# Altium project pcb_75.PrjPcb
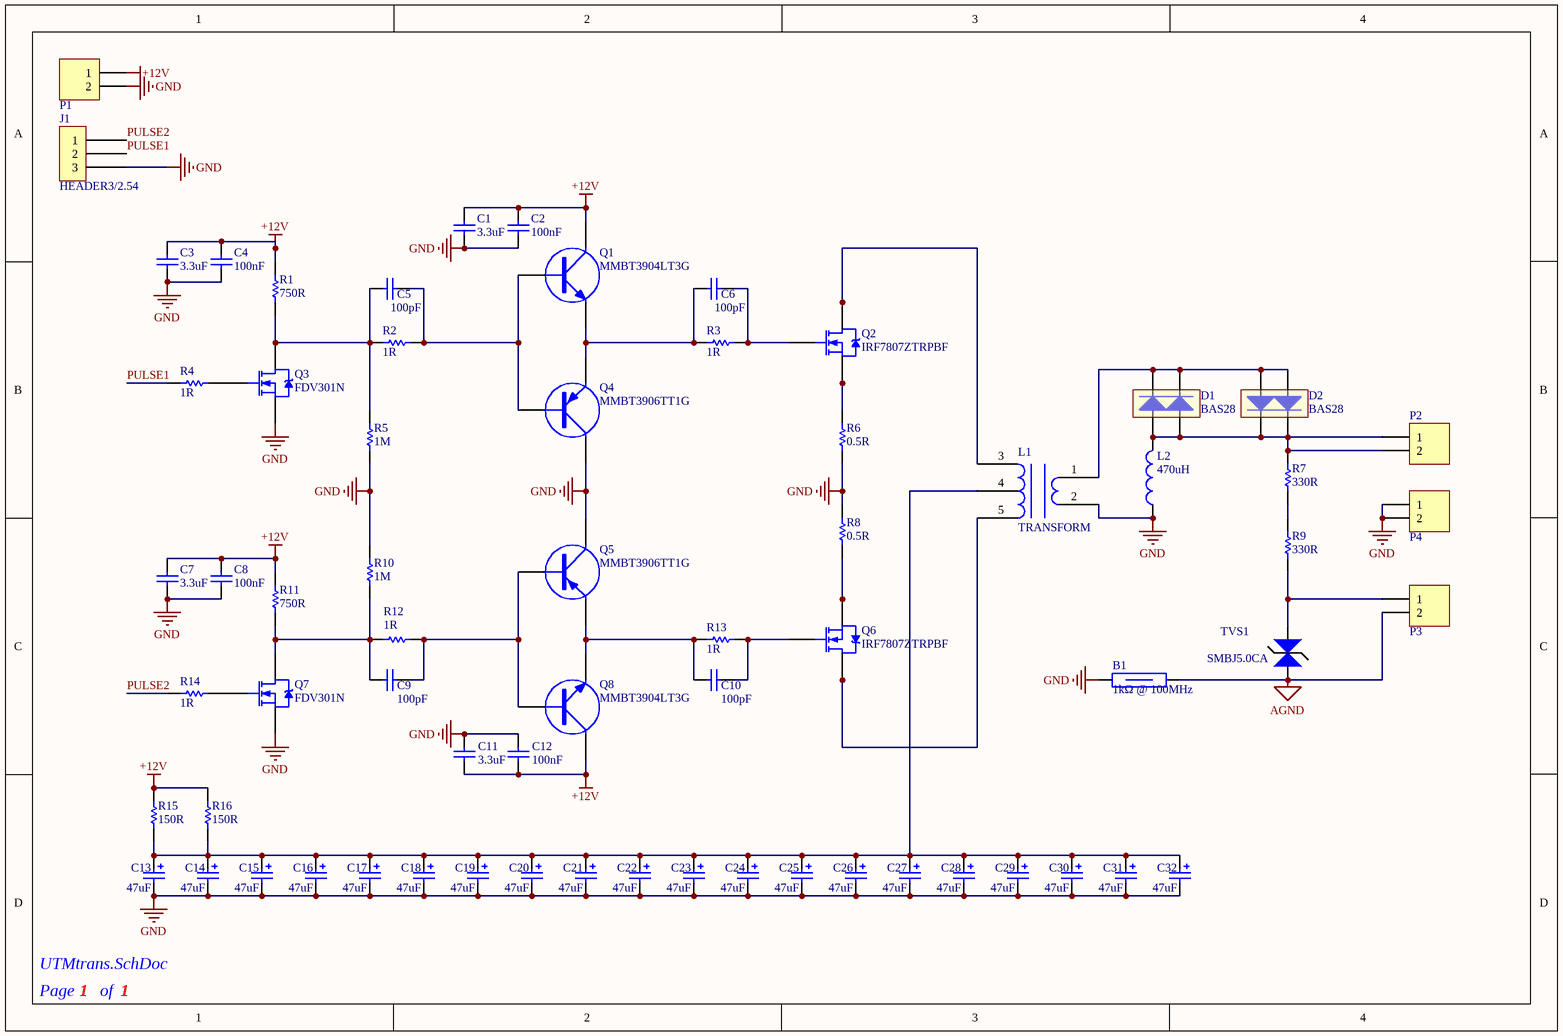
[diagram p0: UTMtrans.SchDoc]
1 sheet, 67 parts. Net scope: global (net labels, ports and power ports of the same name join across sheets).
Board file: pcb_75.PcbDoc

## Sheet UTMtrans.SchDoc
size A4; SheetNumber: 1; SheetTotal: 1

### Parts
B1  1kΩ @ 100MHz  [R1206_L]
C1  3.3uF  [R0805_C]
C2  100nF  [R0603_C]
C3  3.3uF  [R0805_C]
C4  100nF  [R0603_C]
C5  100pF  [R0603_C]
C6  100pF  [R0603_C]
C7  3.3uF  [R0805_C]
C8  100nF  [R0603_C]
C9  100pF  [R0603_C]
C10  100pF  [R0603_C]
C11  3.3uF  [R0805_C]
C12  100nF  [R0603_C]
C13  47uF  [CASE-E_7343]
C14  47uF  [CASE-E_7343]
C15  47uF  [CASE-E_7343]
C16  47uF  [CASE-E_7343]
C17  47uF  [CASE-E_7343]
C18  47uF  [CASE-E_7343]
C19  47uF  [CASE-E_7343]
C20  47uF  [CASE-E_7343]
C21  47uF  [CASE-E_7343]
C22  47uF  [CASE-E_7343]
C23  47uF  [CASE-E_7343]
C24  47uF  [CASE-E_7343]
C25  47uF  [CASE-E_7343]
C26  47uF  [CASE-E_7343]
C27  47uF  [CASE-E_7343]
C28  47uF  [CASE-E_7343]
C29  47uF  [CASE-E_7343]
C30  47uF  [CASE-E_7343]
C31  47uF  [CASE-E_7343]
C32  47uF  [CASE-E_7343]
D1  BAS28  [SOT143]
D2  BAS28  [SOT143]
J1  HEADER3/2.54  [SIP3/2.54]
L1  TRANSFORM  [TRANS5]
L2  470uH  [CD0.254]
P1  Header 2  [CP1X2]  (value not drawn)
P2  Header 2  [CP1X2]  (value not drawn)
P3  Header 2  [CP1X2]  (value not drawn)
P4  Header 2  [CP1X2]  (value not drawn)
Q1  MMBT3904LT3G  [SOT-23(SOT-23-3)]
Q2  IRF7807ZTRPBF  [SOP-8_150mil]
Q3  FDV301N  [SOT-23]
Q4  MMBT3906TT1G  [SOT-23(SOT-23-3)]
Q5  MMBT3906TT1G  [SOT-23(SOT-23-3)]
Q6  IRF7807ZTRPBF  [SOP-8_150mil]
Q7  FDV301N  [SOT-23]
Q8  MMBT3904LT3G  [SOT-23(SOT-23-3)]
R1  750R  [R2512_R]
R2  1R  [R0603_R]
R3  1R  [R0603_R]
R4  1R  [R0603_R]
R5  1M  [R0603_R]
R6  0.5R  [R2512_R]
R7  330R  [R2512_R]
R8  0.5R  [R2512_R]
R9  330R  [R2512_R]
R10  1M  [R0603_R]
R11  750R  [R2512_R]
R12  1R  [R0603_R]
R13  1R  [R0603_R]
R14  1R  [R0603_R]
R15  150R  [R2512_R]
R16  150R  [R2512_R]
TVS1  SMBJ5.0CA  [SMB]

### Nets
+12V: C1.2 C2.2 C3.2 C4.2 C7.2 C8.2 C11.2 C12.2 P1.1 Q1.3(C) Q8.3(C) R1.2 R11.2 R15.2 R16.2
AGND: B1.2 P3.2 TVS1.1
GND: B1.1 C1.1 C2.1 C3.1 C4.1 C7.1 C8.1 C11.1 C12.1 C13.2 C14.2 C15.2 C16.2 C17.2 C18.2 C19.2 C20.2 C21.2 C22.2 C23.2 C24.2 C25.2 C26.2 C27.2 C28.2 C29.2 C30.2 C31.2 C32.2 J1.3 L1.2 L2.1 P1.2 P4.1 P4.2 Q3.2(S) Q4.3(C) Q5.3(C) Q7.2(S) R5.1 R6.1 R8.2 R10.2
PULSE1: J1.2 R4.1
PULSE2: J1.1 R14.1
NetC5_1: C5.1 Q1.1(B) Q4.1(B) R2.1
NetC5_2: C5.2 Q3.3(D) R1.1 R2.2 R5.2
NetC6_1: C6.1 Q1.2(E) Q4.2(E) R3.1
NetC6_2: C6.2 Q2.4(G) R3.2
NetC9_1: C9.1 Q7.3(D) R10.1 R11.1 R12.1
NetC9_2: C9.2 Q5.1(B) Q8.1(B) R12.2
NetC10_1: C10.1 Q5.2(E) Q8.2(E) R13.1
NetC10_2: C10.2 Q6.4(G) R13.2
NetC13_1: C13.1 C14.1 C15.1 C16.1 C17.1 C18.1 C19.1 C20.1 C21.1 C22.1 C23.1 C24.1 C25.1 C26.1 C27.1 C28.1 C29.1 C30.1 C31.1 C32.1 L1.4 R15.1 R16.1
NetD1_1: D1.1(K) D1.2(K) D2.3(A) D2.4(A) L1.1
NetD1_3: D1.3(A) D1.4(A) D2.1(K) D2.2(K) L2.2 P2.1 P2.2 R7.2
NetL1_3: L1.3 Q2.5(D) Q2.6(D) Q2.7(D) Q2.8(D)
NetL1_5: L1.5 Q6.5(D) Q6.6(D) Q6.7(D) Q6.8(D)
NetP3_1: P3.1 R9.1 TVS1.2
NetQ2_1: Q2.1(S) Q2.2(S) Q2.3(S) R6.2
NetQ3_1: Q3.1(G) R4.2
NetQ6_1: Q6.1(S) Q6.2(S) Q6.3(S) R8.1
NetQ7_1: Q7.1(G) R14.2
NetR7_1: R7.1 R9.2

### Notes on the sheet
- Page
- of

### Library data of the parts
B1 = 1kΩ@100MHz: 阻抗 @ 频率 1kΩ @ 100MHz / 线路数 1 / 额定电流（最大） 2A / 直流电阻（DCR）（最大） 120mΩ; 厂家: FH(风华); 型号: CBM321609U102T; 封装: 1206; 类型: Bead; 订货编码: C139169
C1 C3 C7 C11 = 3.3uF/0805/25V: 精度 ±10% / 容值 3.3uF / 额定电压 25V / 温漂系数（介质材料) X7R; 厂家: TDK; 型号: CGA4J1X7R1E335KT0Y0E; 封装: 0805; 类型: Capacitor; 订货编码: C409449
C2 C4 C8 C12 = 100nF/0603/50V: 精度 ±10% / 容值 100nF / 额定电压 50V / 温漂系数（介质材料) X7R; 厂家: FH(风华); 型号: 0603B104K500NT; 封装: 0603; 类型: Capacitor; 订货编码: C30926
C5 C6 C9 C10 = 100pF/0603/50V: 精度 ±5% / 容值 100pF / 额定电压 50V / 温漂系数（介质材料) C0G; 厂家: FH(风华); 型号: 0603CG101J500NT; 封装: 0603; 类型: Capacitor; 订货编码: C1635
C13-C32 = Cap Pol/47uF/35V: 钽电容 / 精度 ±10% / 容值 47uF / 额定电压 35V / ESR串联电阻 900 mΩ @ 100kHz / 工作温度 -55℃~125℃; 厂家: AVX; 型号: TAJE476K035RNJ; 订货编码: C7233; 封装: CASE-E_7343; 类型: 钽电容
D1 D2 = BAS28,215: 反向恢复时间（trr） 4ns / 直流反向耐压（Vr） 100V / 平均整流电流（Io） 150mA / 正向压降（Vf） 1.25V @ 150mA; 厂家: CJ（江苏长电/长晶）; 封装: SOT-143B; 类型: 开关二极管; 订货编码: C182938; 型号: BAS28,215
J1 = HEADER3/2.54: 3pin,单排,2.54mm间距; 厂家: /; System: Connector; 型号: /; 封装: /; 类型: /; 订货编码: /
L1 = TRANSFORM: X; 厂家: X; 型号: X; 封装: X; 类型: TRANSFORM; 订货编码: X
L2 = 470uH: 工字电感 / 精度 ±10% / 额定电流 380mA / 直流电阻（内阻） 1 Ohm Max / 电感值 470uH; 厂家: TDK; 型号: TSL0808RA-471KR38-PF; 封装: 8.5*8.3; 订货编码: C87595; 类型: 工字电感
P1-P4 = Header 2: Header, 2-Pin; 厂家: /; System: Connector; 型号: /; 封装: /; 类型: /; 订货编码: /
Q1 Q8 = MMBT3904LT3G: 300mW / 集电极电流Ic 200mA / 集射极击穿电压Vce 40V / 晶体管类型 NPN; 厂家: ON(安森美); 封装: SOT23-3; 订货编码: C150052; 型号: MMBT3904LT3G; 类型: NPN
Q2 Q6 = IRF7807ZTRPBF: 漏源电压（Vdss） 30V / 连续漏极电流（Id）（25°C 时） 11A / 栅源极阈值电压 2.25V @ 250uA / 漏源导通电阻 13.8mΩ @ 11A,10V / 最大功率耗散（Ta=25°C） 2.5W / 类型 N沟道; 厂家: Infineon(英飞凌); 封装: SOIC-8_150mil; 类型: MOS(场效应管); 订货编码: C169079; 型号: IRF7807ZTRPBF
Q3 Q7 = FDV301N: 漏源电压（Vdss） 25V / 连续漏极电流（Id）（25°C 时） 220mA / 栅源极阈值电压 1.06V @ 250uA / 漏源导通电阻 4Ω @ 400mA,4.5V / 最大功率耗散（Ta=25°C） 350mW / 类型 N沟道; 厂家: ON(安森美); 封装: SOT-23-3; 类型: MOS(场效应管); 订货编码: C15310; 型号: FDV301N
Q4 Q5 = MMBT3906TT1G: 额定功率 200mW / 集电极电流Ic 200mA / 集射极击穿电压Vce 40V / 晶体管类型 PNP; 厂家: ON(安森美); 封装: SOT23-3; 订货编码: C82042; 型号: MMBT3906TT1G; 类型: PNP
R1 R11 = 750R/2512: 精度 ±1% / 阻值 750Ω / 温度系数 ±100ppm/℃ / 功率 1W; 厂家: UNI-ROYAL(厚声); 型号: CQ121WF7500T4E; 类型: Resistor; 订货编码: C966230; 封装: 2512
R2-R4 R12-R14 = 1R/0603: ±250ppm/℃ / 精度 ±1% / 阻值 1Ω / 功率 0.1W; 厂家: FH(风华); 型号: RS-03L1R00FT; 类型: Resistor; 订货编码: C174300; 封装: 0603
R5 R10 = 1M/0603: 阻值 1MΩ / 精度 ±1% / 温度系数 ±100ppm/℃ / 功率 0.1W /; 厂家: FH(风华); 型号: RS-03K1004FT; 类型: Resistor; 订货编码: C136593; 封装: 0603
R6 R8 = 0.5R/2512: 温度系数 ±800ppm/℃ / 功率 1W / 精度 ±1% / 阻值 0.5Ω; 厂家: UNI-ROYAL(厚声); 型号: 25121WF500LT4E; 类型: Resistor; 订货编码: C27777; 封装: 2512
R7 R9 = 330R/2512: 阻值 330Ω / 精度 ±1% / 温度系数 ±100ppm/℃ / 功率 1W; 厂家: UNI-ROYAL(厚声); 型号: AC2512FK-07330RL; 类型: Resistor; 订货编码: C728177; 封装: 2512
R15 R16 = 150R/2512: 功率 1W / 精度 ±1% / 温度系数 ±100ppm/℃ / 阻值 150Ω; 厂家: UNI-ROYAL(厚声); 型号: 25121WF1500T4E; 类型: Resistor; 订货编码: C474209; 封装: 2512
TVS1 = SMBJ5.0CA: TVS二极管 / 极性 Bidirectional / 峰值脉冲电流（10/1000us） 65.2A / 箝位电压 9.2V / 击穿电压（最小值） 6.4V / 反向关断电压（典型值） 5V; 厂家: VISHAY(威世); 型号: SMBJ5.0CA-E3/52; 订货编码: C91161; 封装: SMB; 类型: TVS二极管

## Assembly variants
高等级阻感容: not fitted J1 P1 P2 P3 P4; alternate parts C1 -> CT41G-0805-X5R-25V-475-K-N, C3 -> CT41G-0805-X5R-25V-475-K-N, R6 -> RM6332(2512)-K-B-0R5-F, R8 -> RM6332(2512)-K-B-0R5-F, R10 -> RMK1608-K-B-1004-F, R5 -> RMK1608-K-B-1004-F, R12 -> RMK1608-K-B-1R0-F, R3 -> RMK1608-K-B-1R0-F, R2 -> RMK1608-K-B-1R0-F, R4 -> RMK1608-K-B-1R0-F, R14 -> RMK1608-K-B-1R0-F, R13 -> RMK1608-K-B-1R0-F, R15 -> RMK6332-K-B-1500-F, R16 -> RMK6332-K-B-1500-F, R7 -> RMK6332-K-B-3300-F, R9 -> RMK6332-K-B-3300-F, R1 -> RMK6332-K-B-7500-F, R11 -> RMK6332-K-B-7500-F, C11 -> CT41G-0805-X5R-25V-475-K-N, C7 -> CT41G-0805-X5R-25V-475-K-N, C12 -> CT41G-0603-X7R-50V-104-K-N, C2 -> CT41G-0603-X7R-50V-104-K-N, C8 -> CT41G-0603-X7R-50V-104-K-N, C4 -> CT41G-0603-X7R-50V-104-K-N, C10 -> CC41-0603-CG-50V-101-J-N, C9 -> CC41-0603-CG-50V-101-J-N, C5 -> CC41-0603-CG-50V-101-J-N, C6 -> CC41-0603-CG-50V-101-J-N, B1 -> PB3216-102/1A0, C13 -> CAK55-H-35V-47uF-K, C20 -> CAK55-H-35V-47uF-K, C19 -> CAK55-H-35V-47uF-K, C22 -> CAK55-H-35V-47uF-K, C27 -> CAK55-H-35V-47uF-K, C25 -> CAK55-H-35V-47uF-K, C28 -> CAK55-H-35V-47uF-K, C18 -> CAK55-H-35V-47uF-K, C29 -> CAK55-H-35V-47uF-K, C32 -> CAK55-H-35V-47uF-K, C31 -> CAK55-H-35V-47uF-K, C26 -> CAK55-H-35V-47uF-K, C24 -> CAK55-H-35V-47uF-K, C23 -> CAK55-H-35V-47uF-K, C17 -> CAK55-H-35V-47uF-K, C30 -> CAK55-H-35V-47uF-K, C21 -> CAK55-H-35V-47uF-K, C16 -> CAK55-H-35V-47uF-K, C15 -> CAK55-H-35V-47uF-K, C14 -> CAK55-H-35V-47uF-K
工业级阻感容: not fitted J1 P1 P2 P3 P4